# Altium schematic sheet 底板-供电.SchDoc
size A4; SheetNumber: 2; SheetTotal: 3
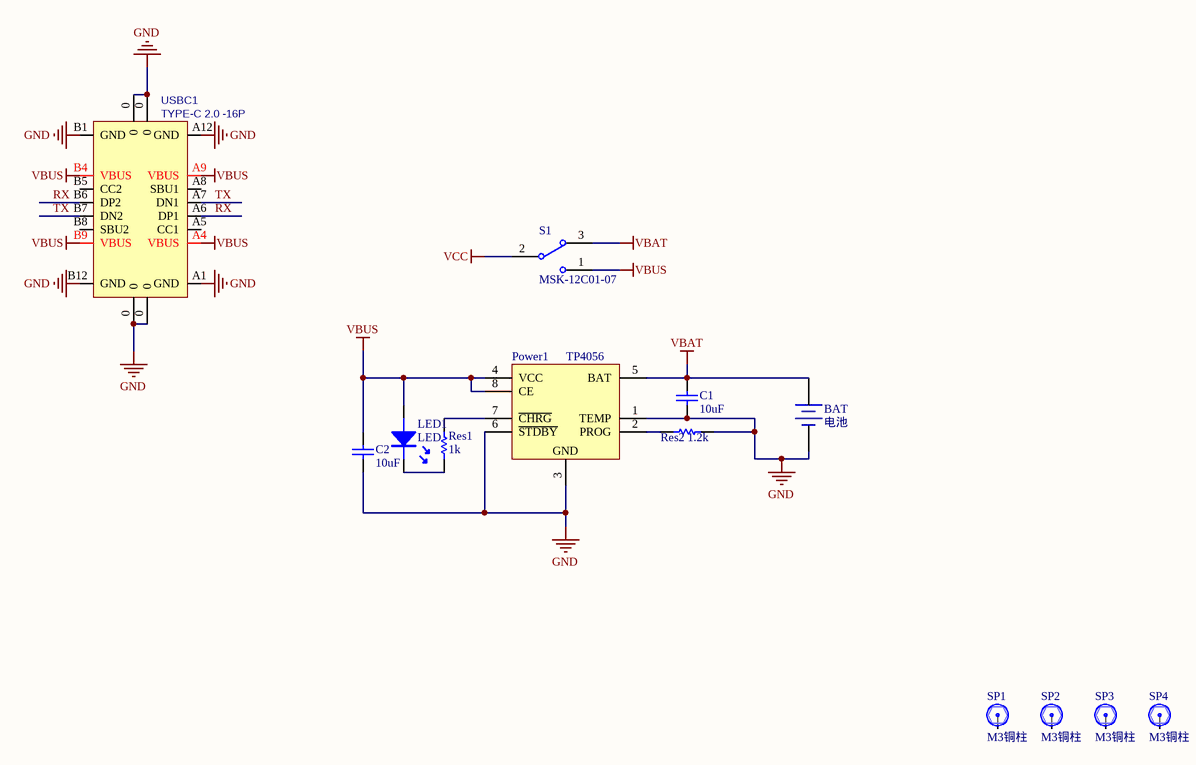
[diagram p0: 底板-供电.SchDoc]

## Parts
BAT  电池  [CR1220_A]
C1  10uF  [C0805_L]
C2  10uF  [C0805_L]
LED1  LED  [LED-0603B]
Power1  TP4056  [SOP8]
Res1  1k  [0805R]
Res2  1.2k  [0805R]
S1  MSK-12C01-07  [MSK-12C01-07]
SP1  M3铜柱  [M3x4_L]
SP2  M3铜柱  [M3x4_L]
SP3  M3铜柱  [M3x4_L]
SP4  M3铜柱  [M3x4_L]
USBC1  TYPE-C 2.0 -16P  [USB-C-SMD_16P]

## Nets
GND: BAT.2(DC-) C1.1 C2.1 Power1.1(TEMP) Power1.3(GND) Power1.6(~{STDBY}) Res2.1 USBC1.0 USBC1.A1(GND) USBC1.A12(GND) USBC1.B1(GND) USBC1.B12(GND)
VBAT: BAT.1(DC+) C1.2 Power1.5(BAT) S1.3
VBUS: C2.2 LED1.A Power1.4(VCC) Power1.8(CE) S1.1 USBC1.A4(VBUS) USBC1.A9(VBUS) USBC1.B4(VBUS) USBC1.B9(VBUS)
VCC: S1.2
RX: USBC1.A6(DP1) USBC1.B6(DP2)
TX: USBC1.A7(DN1) USBC1.B7(DN2)
NetLED1_K: LED1.K Res1.2
NetPower1_2: Power1.2(PROG) Res2.2
NetPower1_7: Power1.7(~{CHRG}) Res1.1

Not connected (* = marked no-connect by the designer): SP1 1; SP2 1; SP3 1; SP4 1; USBC1 A5(CC1) A8(SBU1) B5(CC2) B8(SBU2)

## Library data of the parts
BAT = CR-3V: 微型电池; 联系卖家，免费查找封装: 唯一出售店铺网址https://shop463601444.taobao.com; BOM名称: 微型电池
C1 C2 = Cap: Capacitor; Published: 8-Jun-2000; LatestRevisionDate: 17-Jul-2002; LatestRevisionNote: Re-released for DXP Platform.; PackageReference: RAD-0.3; Publisher: Altium Limited; PackageDescription: Radial Cap, Thru-Hole; 2 Leads; 0.3 in Pin Spacing
Res1 Res2 = RES
SP1-SP4 = 铜柱小焊盘: 铜柱; 联系卖家，免费查找封装: 唯一出售店铺网址https://shop463601444.taobao.com; BOM名称: 铜柱
USBC1 = USB2.0_Type-C_16Pin: USB2.0 Type-C 16Pin  母座; 联系卖家，免费技术支持: 唯一出售店铺网址https://shop463601444.taobao.com; System: Connector